# Altium schematic sheet Sheet1.SchDoc
size A4; Organization: Deutsches Zentrum für Luft-; Address1: und Raumfahrt e.V. (DLR); Address2: Institut für Materialphysik; Address3: im Weltraum; Address4: Linder Höhe - 51147 Köln; SheetNumber: 1; SheetTotal: 1
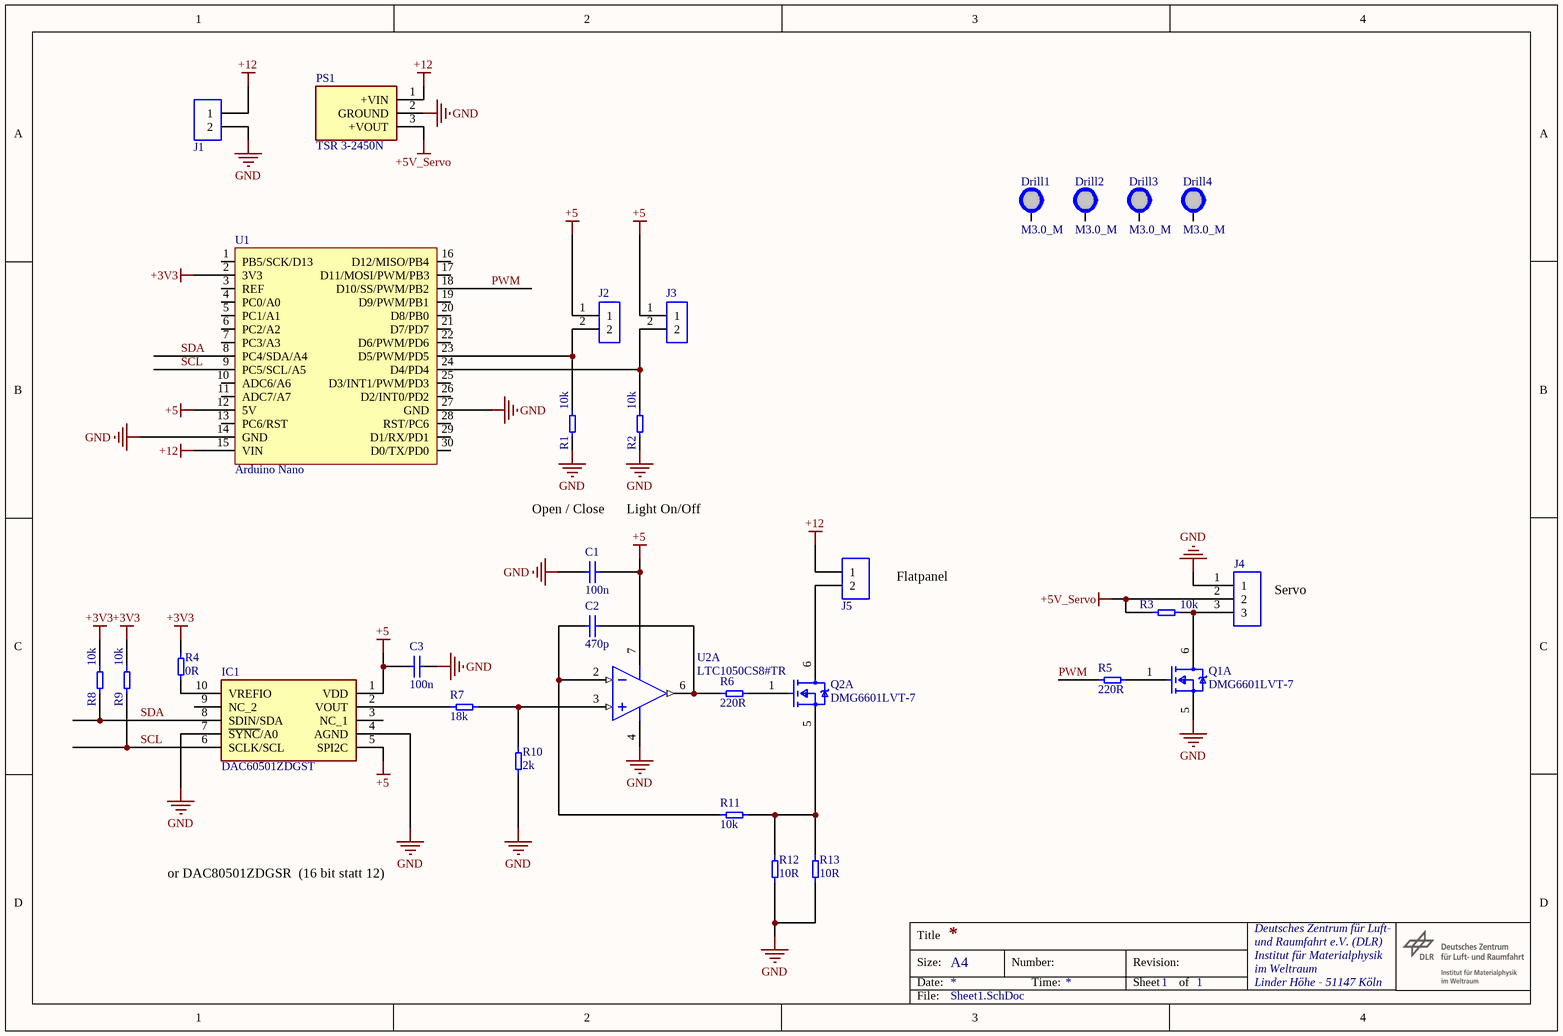
[diagram p0: Sheet1.SchDoc]

## Parts
C1  100n  [C0603_L]
C2  470p  [C0603_L]
C3  100n  [C0603_L]
Drill1  M3.0_M  [M3.0_M]  (no BOM)
Drill2  M3.0_M  [M3.0_M]  (no BOM)
Drill3  M3.0_M  [M3.0_M]  (no BOM)
Drill4  M3.0_M  [M3.0_M]  (no BOM)
IC1  DAC60501ZDGST  [SOP50P490X110-10N]
J1  PM_5.08_3_90_3.5_SW_-176052000  [MKDSN 5,08/2 2,5]  (value not drawn)
J2  896-7620  [2P Stiftleiste 2,54 mm]  (value not drawn)
J3  896-7620  [2P Stiftleiste 2,54 mm]  (value not drawn)
J4  251-8092  [3P Stiftleiste 2,54 mm]  (value not drawn)
J5  PM_5.08_3_90_3.5_SW_-176052000  [MKDSN 5,08/2 2,5]  (value not drawn)
PS1  TSR 3-2450N  [TSR324120N]
Q1  DMG6601LVT-7  [FP-TSOT26-MFG]  (part A of 2)
Q2  DMG6601LVT-7  [FP-TSOT26-MFG]  (part A of 2)
R1  10k  [R0603_M]
R2  10k  [R0603_M]
R3  10k  [R0603_M]
R4  0R  [R0603_M]
R5  220R  [R0603_M]
R6  220R  [R0603_M]
R7  18k  [R0603_M]
R8  10k  [R0603_M]
R9  10k  [R0603_M]
R10  2k  [R0603_M]
R11  10k  [R0603_M]
R12  10R  [R0805_M]
R13  10R  [R0805_M]
U1  Arduino Nano  [Arduino Nano]
U2  LTC1050CS8#TR  [LT-S8-8_L]  (part A of 2)

## Nets
+3V3: R4.1 R8.1 R9.1 U1.2(3V3)
+5: C1.1 C3.1 IC1.1(VDD) IC1.5(SPI2C) J2.1 J3.1 U1.12(5V) U2.7(V+)
+5V_Servo: J4.2 PS1.3(+VOUT) R3.1
+12: J1.1 J5.1 PS1.1(+VIN) U1.15(VIN)
GND: C1.2 C3.2 IC1.4(AGND) IC1.7(~{SYNC}/A0) J1.2 J4.1 PS1.2(GROUND) Q1.5(S1) R1.2 R2.2 R10.1 R12.1 R13.1 U1.14(GND) U1.27(GND) U2.4(V-)
PWM: R5.1 U1.18(D10/SS/PWM/PB2)
SCL: IC1.6(SCLK/SCL) R9.2 U1.9(PC5/SCL/A5)
SDA: IC1.8(SDIN/SDA) R8.2 U1.8(PC4/SDA/A4)
NetC2_1: C2.1 R11.1 U2.2(-IN)
NetC2_2: C2.2 R6.1 U2.6(OUT)
NetIC1_2: IC1.2(VOUT) R7.1
NetIC1_10: IC1.10(VREFIO) R4.2
NetJ2_2: J2.2 R1.1 U1.23(D5/PWM/PD5)
NetJ3_2: J3.2 R2.1 U1.24(D4/PD4)
NetJ4_3: J4.3 Q1.6(D1) R3.2
NetJ5_2: J5.2 Q2.6(D1)
NetQ1_1: Q1.1(G1) R5.2
NetQ2_1: Q2.1(G1) R6.2
NetQ2_5: Q2.5(S1) R11.2 R12.2 R13.2
NetR7_2: R7.2 R10.2 U2.3(+IN)

Not connected (* = marked no-connect by the designer): Drill1 1; Drill2 1; Drill3 1; Drill4 1; IC1 3(NC_1) 9(NC_2); U1 1(PB5/SCK/D13) 3(REF) 4(PC0/A0) 5(PC1/A1) 6(PC2/A2) 7(PC3/A3) 10(ADC6/A6) 11(ADC7/A7) 13(PC6/RST) 16(D12/MISO/PB4) 17(D11/MOSI/PWM/PB3) 19(D9/PWM/PB1) 20(D8/PB0) 21(D7/PD7) 22(D6/PWM/PD6) 25(D3/INT1/PWM/PD3) 26(D2/INT0/PD2) 28(RST/PC6) 29(D1/RX/PD1) 30(D0/TX/PD0)

## Notes on the sheet
- Open / Close
- Light On/Off
- Flatpanel
- (near J4) Servo
- or DAC80501ZDGSR  (16 bit statt 12)
- Title
- Size:
- Date:
- A4
- Number:
- Time:
- Revision:
- Sheet
- of
- File:

## Library data of the parts
C1-C3 = C0603: .CHECKED PCB: RF; Published: 8-Jun-2000; LatestRevisionDate: 29-May-2009; LatestRevisionNote: IPC-7351 Footprint Added.; PackageReference: C1206; Publisher: Altium Limited; PackageDescription: Chip Capacitor; .CHECKED SCH: RF
Drill1-Drill4 = Drill: .CHECKED PCB: RF; .CHECKED SCH: RF
IC1 = DAC60501ZDGST: Integrated Circuit; Manufacturer_Name: Texas Instruments; Datasheet Link: https://www.ti.com/lit/gpn/DAC60501; Height: 1.1mm; Manufacturer_Part_Number: DAC60501ZDGST; Mouser Part Number: 595-DAC60501ZDGST; Mouser Price/Stock: https://www.mouser.co.uk/ProductDetail/Texas-Instruments/DAC60501ZDGST?qs=%252B6g0mu59x7IgTz6VyILPDQ%3D%3D; Arrow Part Number: DAC60501ZDGST; Arrow Price/Stock: https://www.arrow.com/en/products/dac60501zdgst/texas-instruments?region=nac
J1 J5 = MKDSN 5,08/2 2,5: 间距5.08mm 2pin 10A 300V 可拼接 螺钉式 直插 配线24-14AWG(0.2-2.5)mm²; Manufacturer: Phoenix Contact; Manufacturer Part Number: 1888687; .CHECKED PCB: PS; Current Rating: 16A; Number of Contacts: 2; Voltage Rating: 400V; Number of Levels: 1; Connector Type: Screw; Max Supply Voltage: 250V; Gender: Male; Wire Gauge (Max): 30AWG; Wire Gauge (Min): 12AWG; Wire/Cable Gauge: 24AWG; Pitch: 5.08mm; Approvals: UL,VDE,cULus,CB,EAC; .CHECKED SCH: PS; Supplier 1: RSComponents; Supplier Part Number 1: 8045095; RoHS: Yes; Category: Terminal Blocks; Stock 1: 462; Mount: Through Hole; Number of Pins: 2; Housing Material: Polyamide; Contact Material: Tin; Color: Green; Weight: 0.114993oz; Material: Polyamide; Housing Color: Green; Termination: Screw; Packaging: Bulk; Package Quantity: 50; Orientation: Straight; Number of Rows: 1; Max Current Rating: 16A; Number of Positions Per Level: 2; Current: 10A; Voltage: 300V; Series: COMBICON MKDSN; Number of Positions: 2; Number of Circuits: 2; Number of Poles: 2; Length: 11.6mm; Width: 9.5mm; Height: 10.16mm; Depth: 9.5mm; REACH SVHC: Unknown; RoHS Compliant: Yes; Lead Free: Lead Free; Flammability Rating: UL94 V-0; ComponentLink1URL: https://datasheet.ciiva.com/5765/528137-5765413.pdf?src-supplier=Farnell; ComponentLink1Description: https://datasheet.ciiva.com/5765/528137-5765413.pdf?src-supplier=Farnell; ComponentLink2URL: https://datasheet.ciiva.com/16047/1888687-16047138.pdf?src-supplier=Onlinecomponents.com; ComponentLink2Description: https://datasheet.ciiva.com/16047/1888687-16047138.pdf?src-supplier=Onlinecomponents.com; ComponentLink3URL: https://datasheet.ciiva.com/6751/1888687-6751366.pdf?src-supplier=Digi-Key; ComponentLink3Description: https://datasheet.ciiva.com/6751/1888687-6751366.pdf?src-supplier=Digi-Key; ComponentLink4URL: https://datasheet.ciiva.com/29226/774087-da-01-en-printklemme-1888687-250-st-29226666.pdf?src-supplier=Conrad; ComponentLink4Description: https://datasheet.ciiva.com/29226/774087-da-01-en-printklemme-1888687-250-st-29226666.pdf?src-supplier=Conrad; Supplier 2: Farnell; Supplier Part Number 2: 1792766
J2 J3 = 2P Stiftleiste 2,54: 7 Pin Stiftleiste Raster 2,54 mm / 2.54mm Pitch 7 Way 1 Row Straight PCB Header, Solder Termination / RS Nr.: 896-7620; Manufacturer_Name: Molex; Manufacturer_Part_Number: 42375-0002; Geometry.Height: 8.69mm; .CHECKED PCB: RF; RS Part Number: 896-7620; Datasheet Link: https://componentsearchengine.com/Datasheets/3/61300711121.pdf; .CHECKED SCH: RF
J4 = 3P Stiftleiste 2,54: 3 Pin Stiftleiste Raster 2,54 mm / Wurth Elektronik WR-PHD Series, Series Number 6130, 2.54mm Pitch 7 Way 1 Row Straight PCB Header, Solder Termination / RS Nr.: 61300711121; Geometry.Height: 8.69mm; .CHECKED PCB: RF; RS Part Number: 251-8092; Manufacturer_Name: RS; Manufacturer_Part_Number: 251-8092; Datasheet Link: https://docs-emea.rs-online.com/webdocs/1584/0900766b81584a98.pdf; .CHECKED SCH: RF
PS1 = TSR_3-24120N: or TSR 3-2450N; Manufacturer_Name: Traco Power; Datasheet Link: https://tracopower.com/tsr3n-datasheet/; Height: 10.7mm; Manufacturer_Part_Number: TSR 3-2450N; Mouser Part Number: TSR 3-2450N; Mouser Price/Stock: https://www.mouser.co.uk/ProductDetail/TRACO-Power/TSR-3-24120N?qs=7%2F6SraaimPQ2uf1LtAOePA%3D%3D
Q1 Q2 = CMP-2000-06173-2: MOSFET N/P-CH 30V 26TSOT; Manufacturer: Diodes Inc.; Max Junction Temp: +150°C; Automotive Grade: Grade 0; Turn On Delay Time: 1.6/1.7ns; Number Of N Channels: 1; Turn Off Delay Time: 31.2/18.3ns; Threshold Vgs Min: 0.5/-0.4V; Depletion Mode: False; Pulse Drain Current: 20/-15A; Max Forward Diode Voltage: 1V; Threshold Vgs Max: 1.5/-1.2V; Drain To Source Resistance: 34/70mΩ; Typ Forward Diode Voltage: 0.75/-0.8V; Gate To Source Voltage: 12V; Number Of Channels: 2; Rthja Max: 147°C/W; Continuous Drain Current: 3.8/-2.5A; Power Dissipation: 0.85W; Standoff Height: 0.01mm; RoHS: TRUE; Height: 1mm; Digikey Description: MOSFET N/P-CH 30V 26TSOT; Drain To Source Breakdown Voltage: 30V; Device Class L3: MOSFETs; Ipc Land Pattern Name: SOT95P280X100-6; Octopart: https://octopart.com/dmg6601lvt-7-diodes+inc.-24548281; Temperature Range Low: -55°C; Manufacturer Part Number: DMG6601LVT-7; Mouser Description: N & P-Channel 30 V 110 mO Complementary Pair Enhancement Mode Mosfet; Category: Trans; Temperature Range High: +150°C; Automotive: Yes; Device Class L2: Transistors; Footprint Url: https://www.diodes.com/assets/Package-Files/TSOT26.pdf; Number Of P Channels: 1; Lead Free: Yes; ComponentLink2URL: https://www.diodes.com/assets/Datasheets/DMG6601LVT.pdf; Device Class L1: Discrete Semiconductors; Temperature: -55°C to +150°C; ComponentLink2Description: Datasheet; Drain To Source Voltage: 30V; Package: TSOT26
R1-R11 = R0603: Manufacture: Bourns; Manufacture Nr: PWR263S-35-7R50F; Power: 35 W; Gehäuse: T0-263; Value: 7,5 Ohm; .CHECKED PCB: RF; Published: 8-Jun-2000; LatestRevisionDate: 17-Jul-2002; LatestRevisionNote: Re-released for DXP Platform.; PackageReference: AXIAL-0.3; Publisher: Altium Limited; PackageDescription: Axial Device, Thru-Hole; 2 Leads; 0.3 in Pin Spacing; Distributor: RS; Distributor Nr: 733-2688; Datasheet: https://docs-emea.rs-online.com/webdocs/0f73/0900766b80f73c76.pdf; .CHECKED SCH: RF
R12 R13 = R0805: Manufacture: Bourns; Manufacture Nr: PWR263S-35-7R50F; Power: 35 W; Gehäuse: T0-263; Value: 7,5 Ohm; .CHECKED PCB: RF; Published: 8-Jun-2000; LatestRevisionDate: 17-Jul-2002; LatestRevisionNote: Re-released for DXP Platform.; PackageReference: AXIAL-0.3; Publisher: Altium Limited; PackageDescription: Axial Device, Thru-Hole; 2 Leads; 0.3 in Pin Spacing; Distributor: RS; Distributor Nr: 733-2688; Datasheet: https://docs-emea.rs-online.com/webdocs/0f73/0900766b80f73c76.pdf; .CHECKED SCH: RF
U1 = Arduino Nano: Nano Every Development Brd, 8Bit Avr Mcu Rohs Compliant: Yes; Manufacturer Part Number: ABX00028; .SCH Checked: PS; Supplier 1: Digi-Key; Supplier Part Number 1: 1050-ABX00028-ND; Manufacturer: Arduino; RoHS: No; Category: Embedded Processors and Controllers; Stock 1: 489; .PCB Checked: PS
U2 = CMP-0359-03069-2: Single Channel, Precision, Zero-Drift Operational Amplifier with Internal Capacitors, 2.5 MHz Typical GBW, 4 V/us Typical SR, 4.75 to 18 V, 8-Pin SOIC (S8-8), Commercial, Reel; Manufacturer: Linear Technology; Vs Max (V): 18; Vs Min (V): 4.75; Vos (mV) Typical: 0.0005; Is (mA) Typical: 1; GBW (MHz) Typical: 2.5; SR (V/us) Typical: 4; Mounting Technology: Surface Mount; RevisionNote: URLs updated; ComponentLink3Description: Package Specification; Type: ZD; PartNumber: LTC1050CS8#TR; Channels (#): 1; ComponentLink1URL: http://www.linear.com/; ComponentLink3URL: http://cds.linear.com/docs/en/packaging/05081610_G_SO8.pdf; ComponentLink2URL: http://cds.linear.com/docs/en/datasheet/1050fb.pdf; PackageReference: LT-S8-8; ComponentLink1Description: Manufacturer URL; ComponentLink2Description: Datasheet; PackageVersion: Rev G; Linear Technology Part Number: LTC1050; PackageDescription: 8-Pin Plastic Small Outline, Body 4.9 x 3.9 mm, Pitch 1.27 mm; Packing: Reel